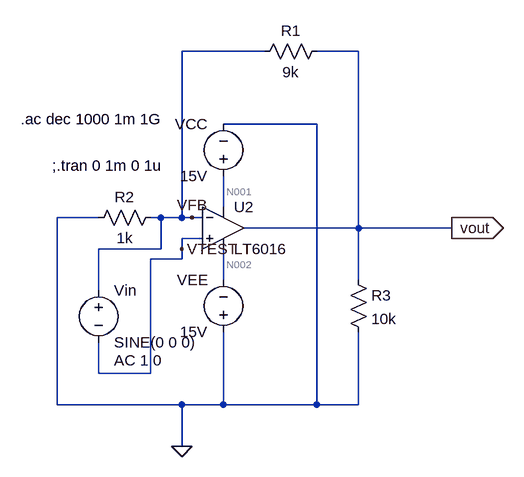
[diagram p0: schematic non-inverting amp opamp.asc]
* non-inverting amp opamp.asc
* U2: LT6016 (symbol OpAmps\LT6016 not available, pins judged from their places): In+=VTEST In-=VFB V+=N001 V-=N002 OUT=vout
R1 vout VFB 9k
R2 VFB 0 1k
Vin VFB VTEST SINE(0 0 0) AC 1 0
VCC N001 0 15V
VEE 0 N002 15V
R3 vout 0 10k
;.tran 0 1m 0 1u
.ac dec 1000 1m 1G
.backanno
.end

* Results of the author's LTspice run, read from the files saved beside the schematic
* Operating Point, zero values left out:
*   V(n002) = -15 V
*   V(n001) = 15 V
*   V(vout) = -39.03 mV
*   V(vtest) = -3.906 mV
*   V(vfb) = -3.906 mV
*   I(R3) = -3.903 µA
*   I(R2) = -3.906 µA
*   I(R1) = -3.903 µA
*   I(Vee) = -346 µA
*   I(Vcc) = -338.2 µA
*   I(Vin) = 1.76 nA
*   Ix(u2:1) = 1.76 nA
*   Ix(u2:2) = 1.76 nA
*   Ix(u2:3) = 338.2 µA
*   Ix(u2:4) = -346 µA
*   Ix(u2:5) = 7.806 µA
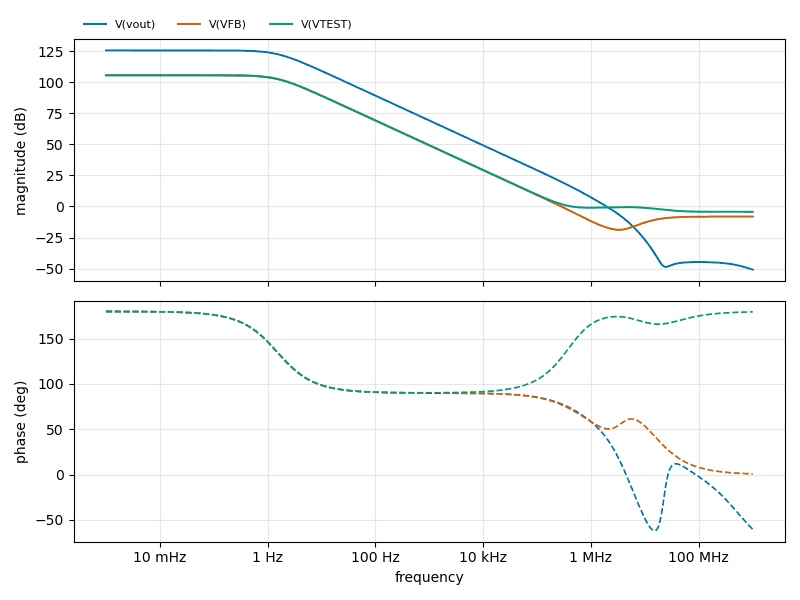
[diagram p1: AC Analysis of non-inverting amp opamp.asc, plotted from the saved traces]
* AC Analysis, 1 run:
*   V(vout): 125.67 dB at 1 mHz, -50.90 dB at 1 GHz, peak 125.67 dB at 1 mHz, 3 dB below the peak at 1.51 Hz
*   V(VFB): 105.67 dB at 1 mHz, -8.15 dB at 1 GHz, peak 105.67 dB at 1 mHz, 3 dB below the peak at 1.51 Hz
*   V(VTEST): 105.67 dB at 1 mHz, -4.31 dB at 1 GHz, peak 105.67 dB at 1 mHz, 3 dB below the peak at 1.51 Hz